# EAGLE design Pendulum Lamp PCB (EAGLE 8.6.3)
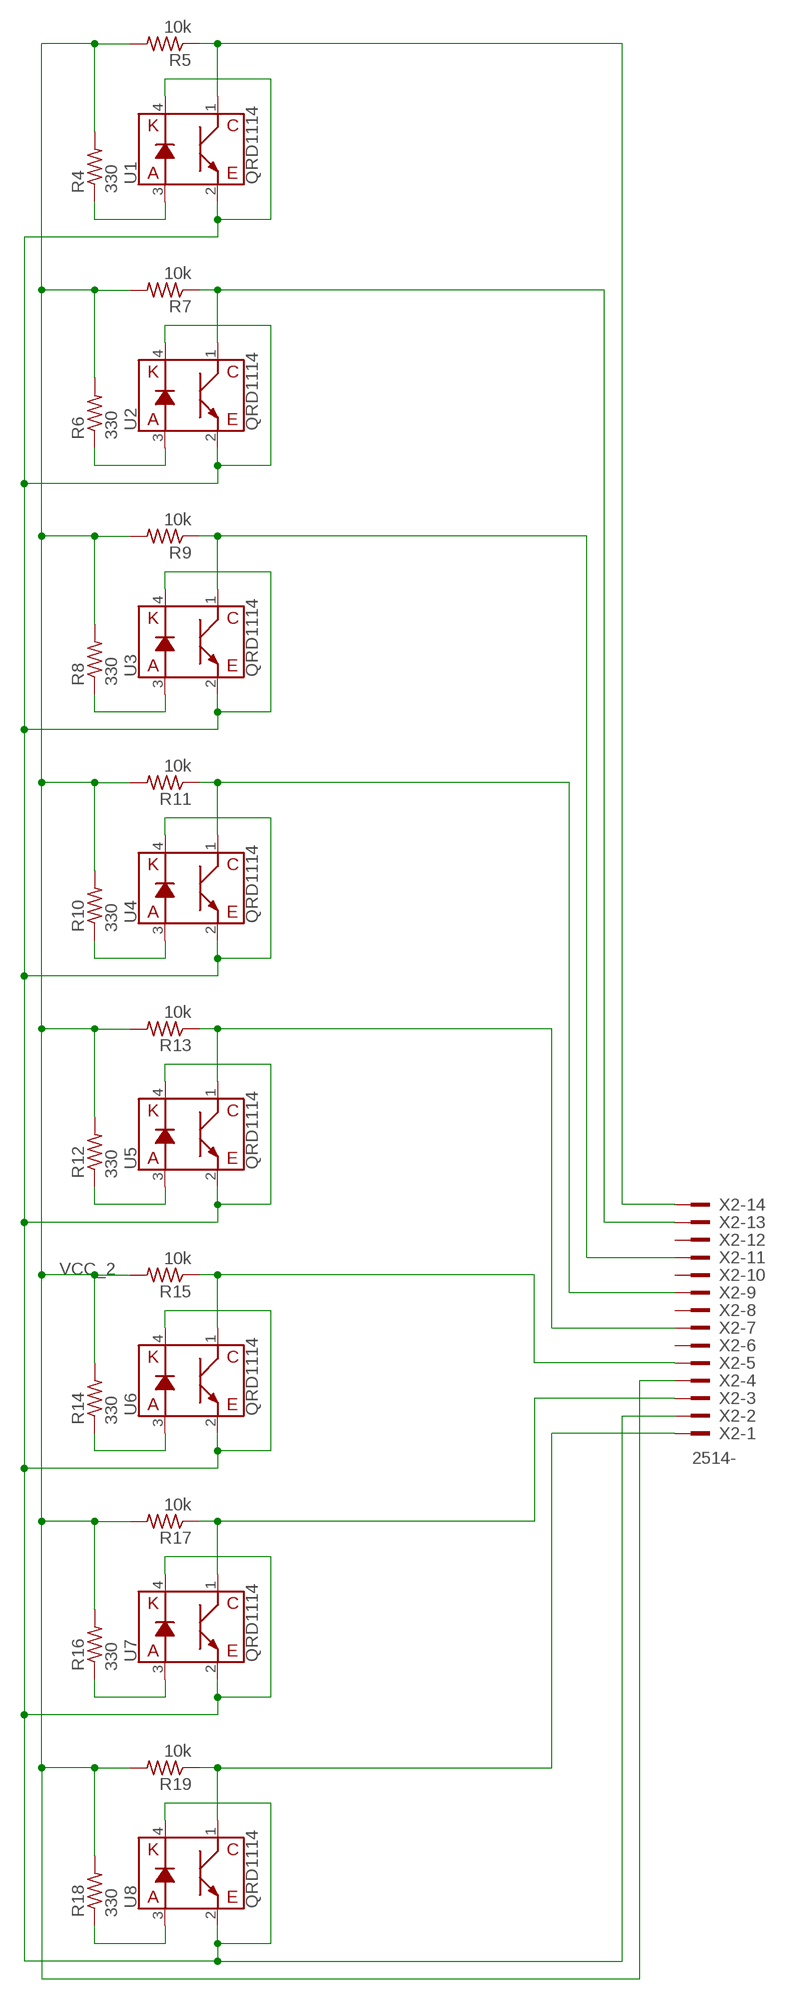
[diagram p0: schematic, sheet 1]

## Parts
R4  330  R-US_0204/7  [0204/7]
R5  10k  R-US_0204/7  [0204/7]
R6  330  R-US_0204/7  [0204/7]
R7  10k  R-US_0204/7  [0204/7]
R8  330  R-US_0204/7  [0204/7]
R9  10k  R-US_0204/7  [0204/7]
R10  330  R-US_0204/7  [0204/7]
R11  10k  R-US_0204/7  [0204/7]
R12  330  R-US_0204/7  [0204/7]
R13  10k  R-US_0204/7  [0204/7]
R14  330  R-US_0204/7  [0204/7]
R15  10k  R-US_0204/7  [0204/7]
R16  330  R-US_0204/7  [0204/7]
R17  10k  R-US_0204/7  [0204/7]
R18  330  R-US_0204/7  [0204/7]
R19  10k  R-US_0204/7  [0204/7]
U1  QRD1114  [QRD1114]
U2  QRD1114  [QRD1114]
U3  QRD1114  [QRD1114]
U4  QRD1114  [QRD1114]
U5  QRD1114  [QRD1114]
U6  QRD1114  [QRD1114]
U7  QRD1114  [QRD1114]
U8  QRD1114  [QRD1114]
X2  2514-  [PAK100/2500-14]

## Nets
GND_2: U1.2(E) U1.4(K) U2.2(E) U2.4(K) U3.2(E) U3.4(K) U4.2(E) U4.4(K) U5.2(E) U5.4(K) U6.2(E) U6.4(K) U7.2(E) U7.4(K) U8.2(E) U8.4(K) X2.2
N$30: R4.1 U1.3(A)
N$31: R5.1 U1.1(C) X2.14
N$34: R6.1 U2.3(A)
N$36: R7.1 U2.1(C) X2.13
N$38: R8.1 U3.3(A)
N$40: R9.1 U3.1(C) X2.11
N$42: R10.1 U4.3(A)
N$44: R11.1 U4.1(C) X2.9
N$46: R12.1 U5.3(A)
N$48: R13.1 U5.1(C) X2.7
N$50: R14.1 U6.3(A)
N$52: R15.1 U6.1(C) X2.5
N$54: R16.1 U7.3(A)
N$56: R17.1 U7.1(C) X2.3
N$58: R18.1 U8.3(A)
N$60: R19.1 U8.1(C) X2.1
VCC_2: R4.2 R5.2 R6.2 R7.2 R8.2 R9.2 R10.2 R11.2 R12.2 R13.2 R14.2 R15.2 R16.2 R17.2 R18.2 R19.2 X2.4
Unconnected: X2.6 X2.8 X2.10 X2.12

## Library data of the parts
R4-R19 = rcl:R-US_: RESISTOR, American symbol; SPICEPREFIX: R
U1-U8 = SparkFun-Sensors:QRD1114: QRD1114 Reflective Proximity, Object Sensor This sensor uses an infrared emitted diode combined with an infrared phototransistor to detect the reflected infrared signal. Ideal for sensing black-to-white transitions or can be used to detect nearby objects (.5-1cm). Datasheet <http://www.sparkfun.com/datasheets/BOT/QRD1114.pdf> SparkFun Products Optical Detector / Phototransistor - QRD1114 <https://www.sparkfun.com/products/246> (SEN-00246); PROD_ID: IC-09032; SF_ID: SEN-00246
X2 = con-3m:2514-: 3M (TM) Pak 100 4-Wall Header Source: 3M; OC_FARNELL: unknown; OC_NEWARK: unknown

## Board
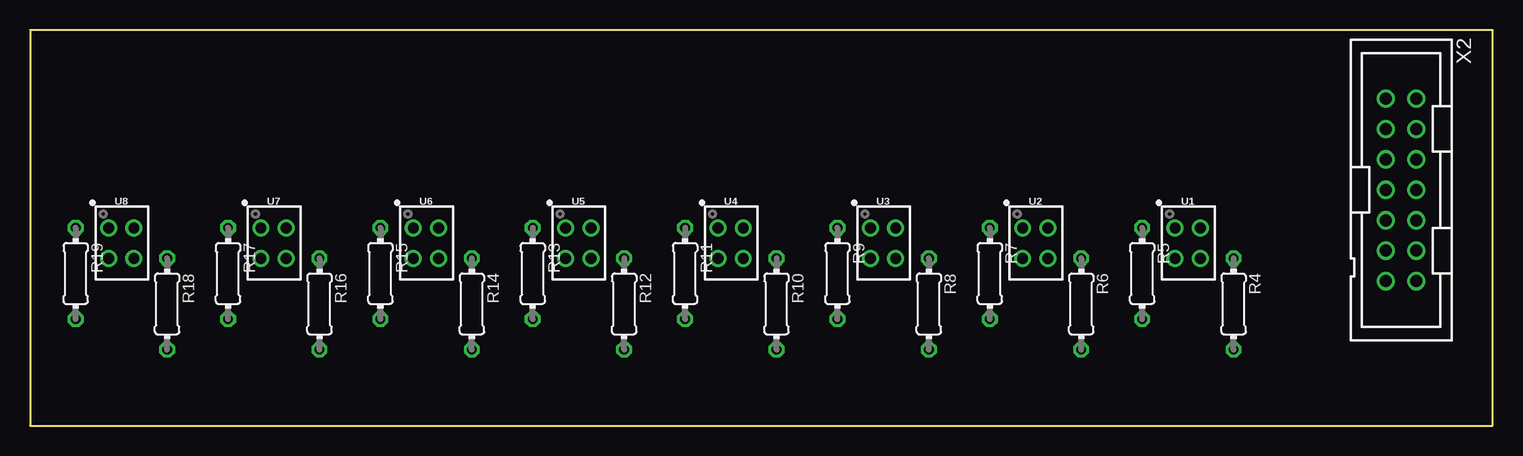
[diagram p1: board, top side]
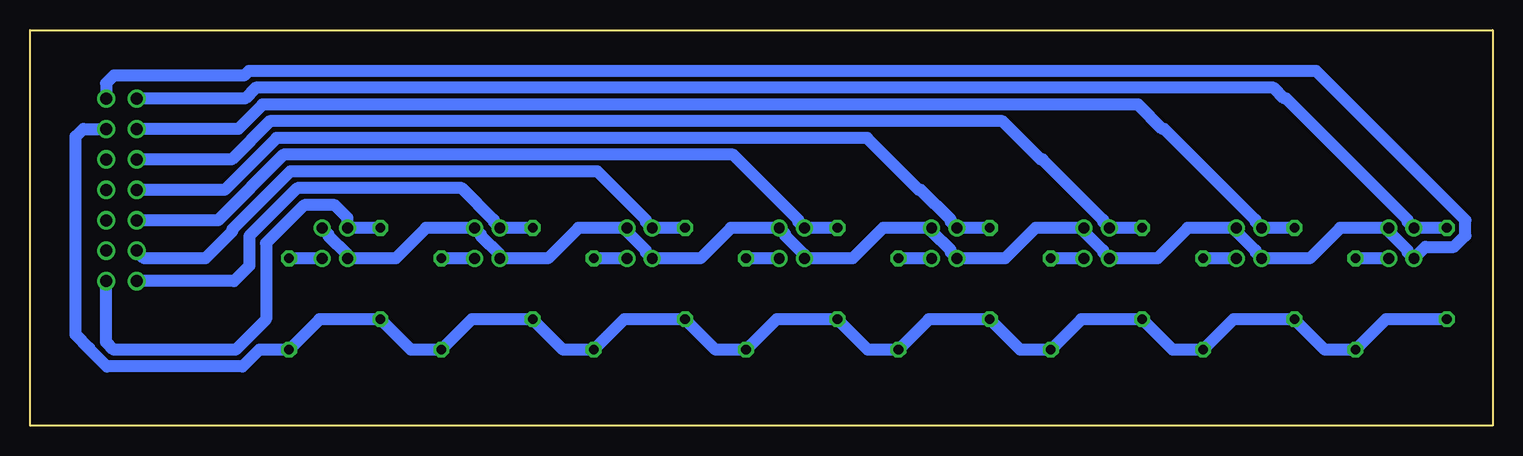
[diagram p2: board, bottom side, seen from below]

Size 121.92 x 33.02 mm. Coordinates in mm from the lower left corner, seen from the top.
Outline: 0,0 121.92,0 121.92,33.02 0,33.02 0,0
Copper layers (1*16): Top 0.035mm / dielectric 1.5mm / Bottom 0.035mm
Design rules "default *": minimum track width 6mil, minimum drill 0.35mm, track to track 15mil, track to pad 15mil, pad to pad 15mil, via to via 15mil, smd to smd 15mil, copper to edge 40mil, drill to drill 6mil, minimum pad ring 10mil, minimum via ring 8mil, stop-mask expansion 4mil, vias tented up to drill 0mil, thermal gap 10mil

### Footprints (pad centres in the part's own frame; a part is rotated, then mirrored left to right if it is on the bottom)
0204/7 = drill 0.813 octagon: 1 -3.81,0; 2 3.81,0
QRD1114 = drill 0.9: 1 -1.067,1.27; 2 -1.067,-1.27; 3 1.041,-1.27; 4 1.041,1.27
PAK100/2500-14 = drill 1 pad 1.422: 1 -7.62,-1.27; 2 -7.62,1.27; 3 -5.08,-1.27; 4 -5.08,1.27; 5 -2.54,-1.27; 6 -2.54,1.27; 7 0,-1.27; 8 0,1.27; 9 2.54,-1.27; 10 2.54,1.27; 11 5.08,-1.27; 12 5.08,1.27; 13 7.62,-1.27; 14 7.62,1.27

### Placement (x,y rotation side)
R4  100.33,10.16 270 top
R5  92.71,12.7 270 top
R6  87.63,10.16 270 top
R7  80.01,12.7 270 top
R8  74.93,10.16 270 top
R9  67.31,12.7 270 top
R10  62.23,10.16 270 top
R11  54.61,12.7 270 top
R12  49.53,10.16 270 top
R13  41.91,12.7 270 top
R14  36.83,10.16 270 top
R15  29.21,12.7 270 top
R16  24.13,10.16 270 top
R17  16.51,12.7 270 top
R18  11.43,10.16 270 top
R19  3.81,12.7 270 top
U1  96.52,15.24 0 top
U2  83.82,15.24 0 top
U3  71.12,15.24 0 top
U4  58.42,15.24 0 top
U5  45.72,15.24 0 top
U6  33.02,15.24 0 top
U7  20.32,15.24 0 top
U8  7.62,15.24 0 top
X2  114.3,19.68 270 top

### Tracks (layer width: path | path; a pad name or v marks a point on that pad's centre or on a via)
GND_2
  Bottom 1.016: U1.4 97.05,15.99 97.05,15.85 95.45,14.26 U1.2 91.44,13.97 88.9,16.51 U2.4 84.35,15.99 84.35,15.85 82.75,14.26 U2.2 78.74,13.97 76.2,16.51 U3.4 72.16,16.22 70.57,14.63 70.57,14.48 U3.2 66.04,13.97 63.5,16.51 U4.4 58.95,15.99 58.95,15.85 57.35,14.26 U4.2 53.34,13.97 50.8,16.51 U5.4 46.76,16.22 45.17,14.63 45.17,14.48 U5.2 40.64,13.97 38.1,16.51 U6.4 34.06,16.22 32.47,14.63 32.47,14.48 U6.2 27.94,13.97 25.4,16.51 U7.4 21.36,16.22 19.77,14.63 19.77,14.48 U7.2 15.24,13.97 12.7,16.51 U8.4 8.66,16.22 7.07,14.63 7.07,14.48 U8.2 5.61,14.92 3.21,14.92 2.26,15.87 2.26,17.15 14.7,29.59 103.69,29.59 104.07,29.21 114.94,29.21 115.57,28.57 X2.2
N$30
  Bottom 1.016: U1.3 R4.1
N$31
  Bottom 1.016: R5.1 U1.1 95.45,17.35 96.52,18.41 99.06,18.41 102.23,15.24 102.23,8.89 104.78,6.35 114.94,6.35 115.57,6.99 X2.14
N$34
  Bottom 1.016: U2.3 R6.1
N$36
  Bottom 1.016: R7.1 U2.1 83.27,17.02 83.27,17.17 85.91,19.81 99.64,19.81 103.63,15.82 103.63,13.34 104.9,12.06 X2.13
N$38
  Bottom 1.016: U3.3 R8.1
N$40
  Bottom 1.016: R9.1 U3.1 70.57,17.02 70.57,17.17 74.61,21.21 100.22,21.21 105.03,16.4 105.03,16.26 107.31,13.97 112.39,13.97 X2.11
N$42
  Bottom 1.016: U4.3 R10.1
N$44
  Bottom 1.016: R11.1 U4.1 57.87,17.02 57.87,17.17 63.3,22.61 100.8,22.61 106.26,17.14 X2.9
N$46
  Bottom 1.016: U5.3 R12.1
N$48
  Bottom 1.016: R13.1 U5.1 45.17,17.02 45.17,17.17 47.68,19.68 47.83,19.68 52.15,24 101.38,24 105.69,19.68 X2.7
N$50
  Bottom 1.016: U6.3 R14.1
N$52
  Bottom 1.016: R15.1 U6.1 32.47,17.02 32.47,17.17 37.52,22.22 37.67,22.22 40.84,25.4 101.95,25.4 105.13,22.22 X2.5
N$54
  Bottom 1.016: U7.3 R16.1
N$56
  Bottom 1.016: R17.1 U7.1 19.77,17.02 19.77,17.17 27.36,24.76 27.51,24.76 29.54,26.8 102.53,26.8 104.56,24.76 X2.3
N$58
  Bottom 1.016: U8.3 R18.1
N$60
  Bottom 1.016: R19.1 U8.1 7.07,17.02 7.07,17.17 17.2,27.3 17.35,27.3 18.24,28.19 103.11,28.19 104,27.3 X2.1
VCC_2
  Bottom 1.016: R19.2 8.89,8.89 R18.2 13.97,6.35 R17.2 21.59,8.89 R16.2 26.67,6.35 R15.2 34.29,8.89 R14.2 39.37,6.35 R13.2 46.99,8.89 R12.2 52.07,6.35 R11.2 59.69,8.89 R10.2 64.77,6.35 R9.2 72.39,8.89 R8.2 77.47,6.35 R7.2 85.09,8.89 R6.2 90.17,6.35 R5.2 97.79,8.89 R4.2 102.8,6.35 104.2,4.95 115.51,4.95 116.97,6.41 116.97,6.48 118.11,7.62 118.11,24.13 117.47,24.76 X2.4